# Altium schematic sheet PAC_BDD_2.SchDoc
size A4
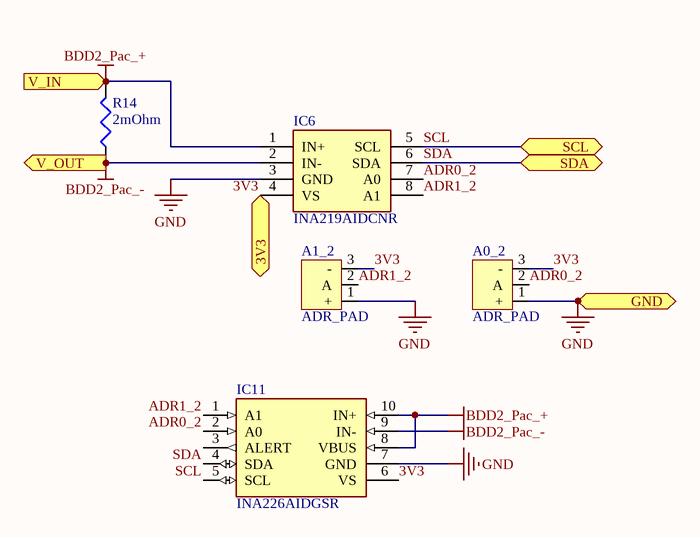
[diagram p0: PAC_BDD_2.SchDoc]

## Parts
A0_2  ADR_PAD  [SOLDER_PAD]
A1_2  ADR_PAD  [SOLDER_PAD]
IC6  INA219AIDCNR  [SOT65P280X145-8N]
IC11  INA226AIDGSR  [SOP50P490X110-10N]
R14  2mOhm  [RESC3216X75N]

## Ports
3V3 (bidir), GND (bidir), SCL (bidir), SDA (bidir), V_IN (in), V_OUT (out)

## Nets
BDD2_Pac_+: IC6.1(IN+) IC11.8(VBUS) IC11.10(IN+) R14.2 ; port V_IN
BDD2_Pac_-: IC6.2(IN-) IC11.9(IN-) R14.1 ; port V_OUT
GND: A0_2.1(+) A1_2.1(+) IC6.3(GND) IC11.7(GND) ; port GND
3V3: A0_2.3(-) A1_2.3(-) IC6.4(VS) IC11.6(VS) ; port 3V3
ADR0_2: A0_2.2(A) IC6.7(A0) IC11.2(A0)
ADR1_2: A1_2.2(A) IC6.8(A1) IC11.1(A1)
SCL: IC6.5(SCL) IC11.5(SCL) ; port SCL
SDA: IC6.6(SDA) IC11.4(SDA) ; port SDA

Not connected (* = marked no-connect by the designer): IC11 3(ALERT)

## Library data of the parts
A0_2 A1_2 = ADR_PAD: ADR PAD 3 PIN
IC6 = INA219BIDCNR: Integrated Circuit; Manufacturer_Name: Texas Instruments; Datasheet Link: http://www.ti.com/lit/ds/symlink/ina219.pdf; Height: 1.45mm; Manufacturer_Part_Number: INA219BIDCNR; Mouser Part Number: 595-INA219BIDCNR; Mouser Price/Stock: https://www.mouser.com/Search/Refine.aspx?Keyword=595-INA219BIDCNR
IC11 = INA226AIDGSR: Integrated Circuit; Manufacturer_Name: Texas Instruments; Datasheet Link: https://componentsearchengine.com/Datasheets/1/INA226AIDGSR.pdf; Height: 1.1mm; Manufacturer_Part_Number: INA226AIDGSR; Arrow Part Number: INA226AIDGSR; Arrow Price/Stock: https://www.arrow.com/en/products/ina226aidgsr/texas-instruments; Mouser Part Number: 595-INA226AIDGSR; Mouser Price/Stock: https://www.mouser.co.uk/ProductDetail/Texas-Instruments/INA226AIDGSR?qs=tQG3bEuiOZD4quG3egR36g%3D%3D
R14 = Res3: Resistor; Published: 8-Jun-2000; LatestRevisionDate: 29-May-2009; LatestRevisionNote: IPC-7351 Footprint Added.; PackageReference: J1-0603; Publisher: Altium Limited; PackageDescription: Chip Resistor; Value: 2mOhm